# EAGLE design Power Board Testing Interface Board manufactured 2016-10-20 (EAGLE 7.7.0)
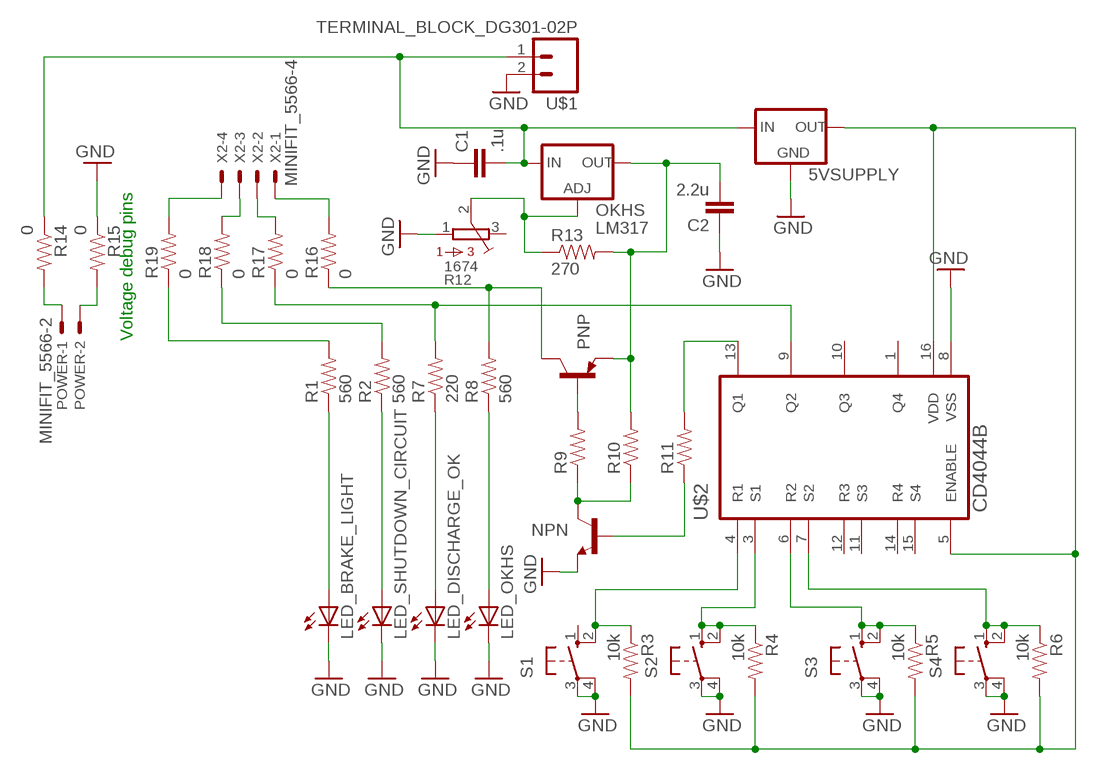
[diagram p0: schematic, sheet 1]

## Parts
5VSUPPLY  5V_REGULATOR_L7805SWITCHING  [TO-220]
C1  .1u  CAPEZ  [CAP-PTH-SMALLEZ]
C2  2.2u  CAPPTH1  [CAP-PTH-5MM]
LED_BRAKE_LIGHT  LED-5MM  [LED-5MM]
LED_DISCHARGE_OK  LED-5MM  [LED-5MM]
LED_OKHS  LED-5MM  [LED-5MM]
LED_SHUTDOWN_CIRCUIT  LED-5MM  [LED-5MM]
NPN  BJT_NPNTIP120  [TO-220]
OKHS  LM317  [TO-220]
PNP  BJT_PNP  [TO-220]
POWER  MINIFIT_5566-2  [MINIFIT_5566-2]
R1  560  RESISTOREZ  [AXIAL-0.3EZ]
R2  560  RESISTOREZ  [AXIAL-0.3EZ]
R3  10k  RESISTOREZ  [AXIAL-0.3EZ]
R4  10k  RESISTOREZ  [AXIAL-0.3EZ]
R5  10k  RESISTOREZ  [AXIAL-0.3EZ]
R6  10k  RESISTOREZ  [AXIAL-0.3EZ]
R7  220  RESISTOREZ  [AXIAL-0.3EZ]
R8  560  RESISTOREZ  [AXIAL-0.3EZ]
R9  RESISTOREZ  [AXIAL-0.3EZ]
R10  RESISTOREZ  [AXIAL-0.3EZ]
R11  RESISTOREZ  [AXIAL-0.3EZ]
R12  1674  TRIMPOT_3296C  [TRIMPOT_3296]
R13  270  RESISTOREZ  [AXIAL-0.3EZ]
R14  0  RESISTOREZ  [AXIAL-0.3EZ]
R15  0  RESISTOREZ  [AXIAL-0.3EZ]
R16  0  RESISTOREZ  [AXIAL-0.3EZ]
R17  0  RESISTOREZ  [AXIAL-0.3EZ]
R18  0  RESISTOREZ  [AXIAL-0.3EZ]
R19  0  RESISTOREZ  [AXIAL-0.3EZ]
S1  BTN_10-XX  [B3F-10XX]
S2  BTN_10-XX  [B3F-10XX]
S3  BTN_10-XX  [B3F-10XX]
S4  BTN_10-XX  [B3F-10XX]
U$1  TERMINAL_BLOCK_DG301-02P  [DG301-02P]
U$2  CD4044B  [DIL16]
X2  MINIFIT_5566-4  [MINIFIT_5566-4]

## Nets
5VSUPPLY: 5VSUPPLY.3(OUT) R3.P$2 R4.P$2 R5.P$2 R6.P$2 U$2.5(ENABLE) U$2.16(VDD)
12VSUPPLY: 5VSUPPLY.1(IN) C1.2 OKHS.3(IN) R14.P$1 U$1.1
GND: 5VSUPPLY.2(GND) C1.1 C2.1 LED_BRAKE_LIGHT.K(C) LED_DISCHARGE_OK.K(C) LED_OKHS.K(C) LED_SHUTDOWN_CIRCUIT.K(C) NPN.3(EMITTER) R12.1 R15.P$1 S1.3(P) S1.4(P1) S2.3(P) S2.4(P1) S3.3(P) S3.4(P1) S4.3(P) S4.4(P1) U$1.2 U$2.8(VSS)
N$2: R1.P$2 R19.P$1
N$3: LED_BRAKE_LIGHT.A R1.P$1
N$4: R2.P$2 R18.P$1
N$5: LED_SHUTDOWN_CIRCUIT.A R2.P$1
N$7: PNP.1(B) R9.P$2
N$8: R11.P$2 U$2.13(Q1)
N$9: R7.P$2 R17.P$1 U$2.9(Q2)
N$10: R3.P$1 S1.2(S1) U$2.4(R1)
N$11: R4.P$1 S2.1(S) S2.2(S1) U$2.3(S1)
N$12: LED_DISCHARGE_OK.A R7.P$1
N$13: LED_OKHS.A R8.P$1
N$14: R5.P$1 S3.1(S) S3.2(S1) U$2.6(R2)
N$15: R6.P$1 S4.1(S) S4.2(S1) U$2.7(S2)
N$16: PNP.2(C) R8.P$2 R16.P$1
N$17: NPN.2(COLLECTOR) R9.P$1 R10.P$1
N$18: NPN.1(BASE) R11.P$1
N$19: POWER.2 R15.P$2
N$20: OKHS.1(ADJ) R12.2 R13.P$1
N$21: C2.2 OKHS.2(OUT) PNP.3(E) R10.P$2 R13.P$2
N$22: POWER.1 R14.P$2
N$23: R16.P$2 X2.1
N$24: R17.P$2 X2.2
N$25: R18.P$2 X2.3
N$26: R19.P$2 X2.4
Unconnected: R12.3 S1.1(S) U$2.1(Q4) U$2.10(Q3) U$2.11(S3) U$2.12(R3) U$2.14(R4) U$2.15(S4)

## Notes on the sheet
- Voltage debug pins

## Library data of the parts
5VSUPPLY = HyTechDevices:5V_REGULATOR_L7805: Voltage Regulator Switching 5v regulator Datasheet <http://power.murata.com/data/power/oki-78sr.pdf> Standard 7805 5V regulator. IGO (Input Ground Output). Spark Fun Electronics SKU : COM-00107 Datasheet <http://www.mouser.com/ds/2/308/MC7800-D-94905.pdf>
C1 C2 = HyTechDevices:CAP: Capacitor Standard 0603 ceramic capacitor, and 0.1" leaded capacitor.
LED_BRAKE_LIGHT LED_DISCHARGE_OK LED_OKHS LED_SHUTDOWN_CIRCUIT = HyTechDevices:LED: Light Emitting Diode Source: Dangerous Prototypes Eagle Library <https://github.com/DangerousPrototypes/Eagle_Part_Library>
NPN = HyTechDevices:BJT_NPN: Generic NPN BJT MMBT2222A - TRANS-08049 (SOT-23, 1A 40V) MPSA42 - TRANS-09116 (SOT-23, 500mA 300V) MMBT5088LT1G - TRANS-11160 (SOT-23, 50 mA 30V) BC547 - COM-08928 <http://www.sparkfun.com/products/8928> (TO-92 45V 100mA) (1.Collector 2.Base 3.Emitter) 2N3904 - COM-00521 <http://www.sparkfun.com/products/521> (TO-92 40V 200mA) (1.Emitter 2.Base 3.Collector) P2N2222A - COM-12852 <http://www.sparkfun.com/products/12852> (TO-92 40V 600mA) (1.Collector 2.Base 3.Emitter) Source: Sparkfun <https://github.com/sparkfun/SparkFun-Eagle-Libraries>
OKHS = HyTechDevices:LM317: Adjustable Linear Regulator
PNP = HyTechDevices:BJT_PNP: Generic PNP BJT
POWER = HyTechDevices:MINIFIT_5566-2: Mini FIT Junior connector 2 pole Source: http://www.molex.com; OC_FARNELL: 1822072; OC_NEWARK: unknown
R1-R11 R13-R19 = HyTechDevices:RESISTOR: Resistor Basic schematic elements and footprints for 0603, 1206, and PTH resistors.
R12 = HyTechDevices:TRIMPOT_3296: 3296 Series 3/8" Square Trimmer Source <https://github.com/chiengineer/Eagle-Libraries/blob/master/Potentiometers/bourns.lbr>
S1-S4 = HyTechDevices:BTN_10-XX: OMRON SWITCH; MPN: B3F-1000; OC_FARNELL: 176432; OC_NEWARK: 36M3542
U$1 = HyTechDevices:TERMINAL_BLOCK_DG301-02P: DG301-02P Terminal block Tayda Electronics Store <http://www.taydaelectronics.com/connectors-sockets/terminal-blocks/dg301-screw-terminal-block-2-positions-5mm.html> Datasheet <http://www.tme.eu/en/Document/72ad9f371bb0c16572574ac47903b3a1/DG301-5.0.pdf> Specs: Positions: 2 Pitch: 5.00mm Wire: 12-24 AWG Max Current: 15A Max Voltage: 300V
U$2 = HyTechDevices:CD4044B: Texas Instruments CD4044B NAND R/S Latch CMOS Quad 3-State NAND R/S Latch
X2 = HyTechDevices:MINIFIT_5566-4: Mini FIT Junior connector 4 pole Source: http://www.molex.com; OC_FARNELL: unknown; OC_NEWARK: unknown

## Board
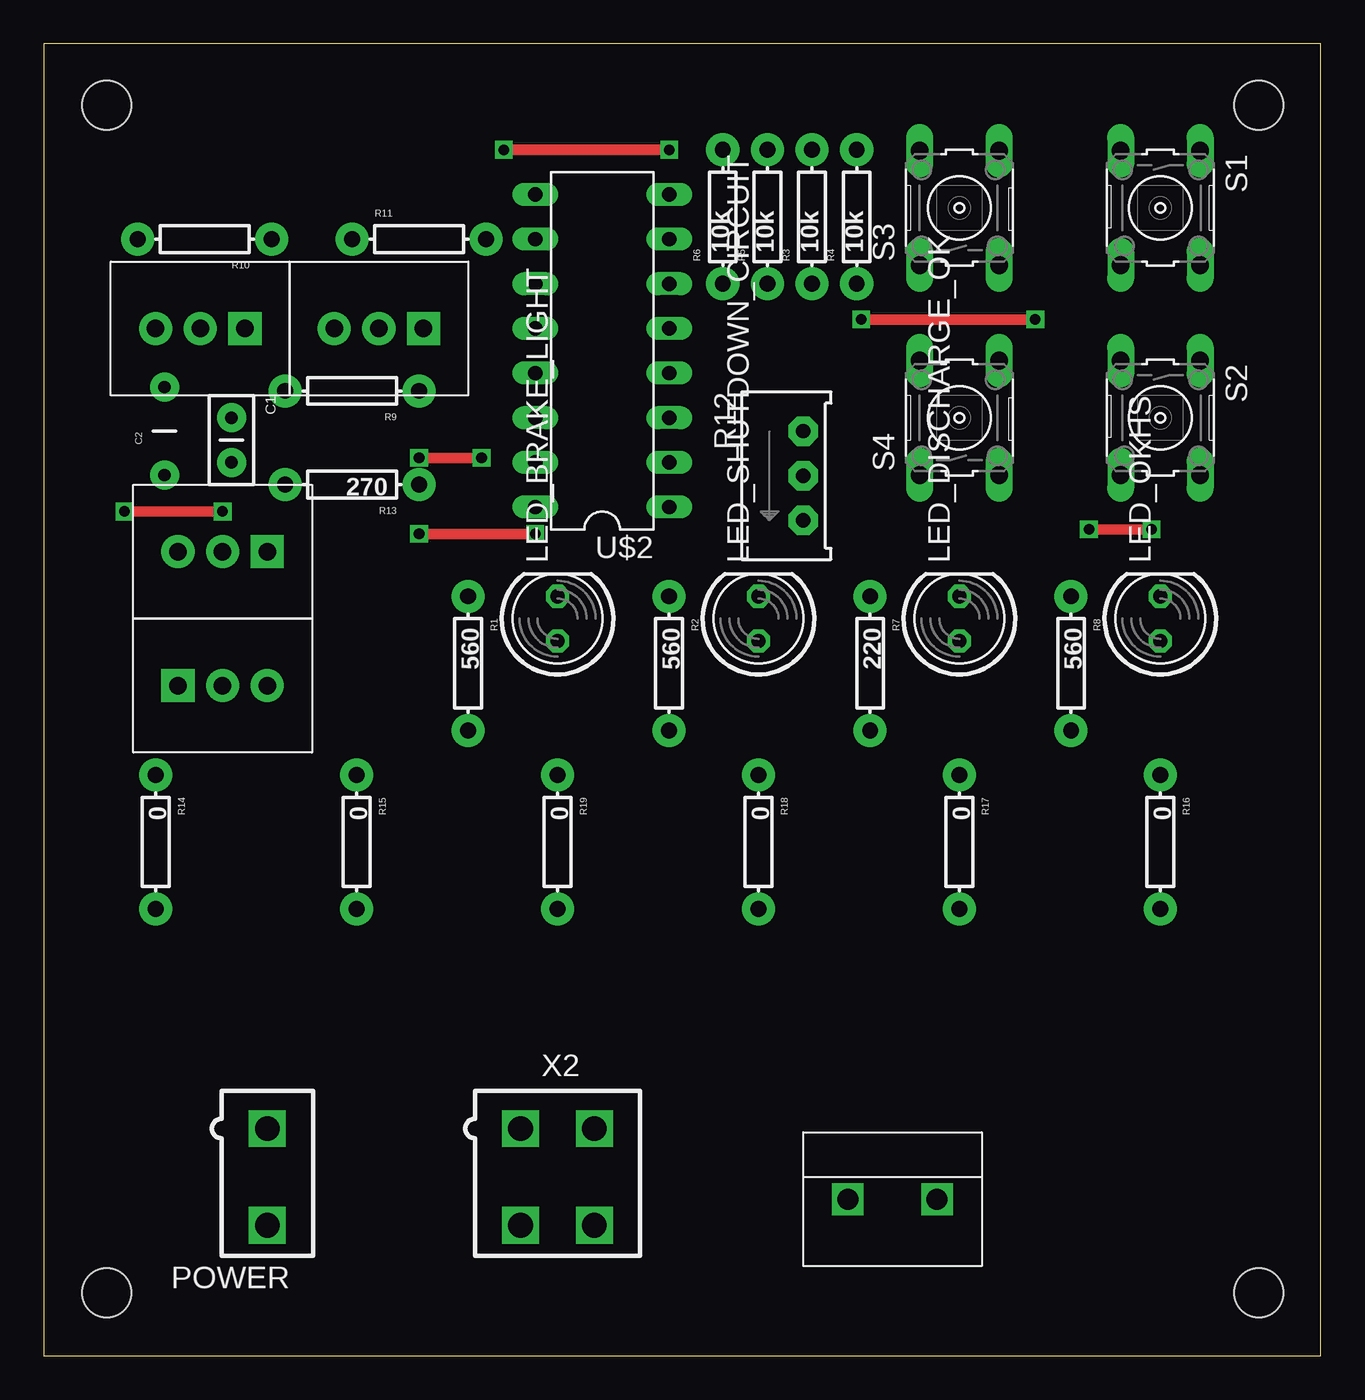
[diagram p1: board, top side]
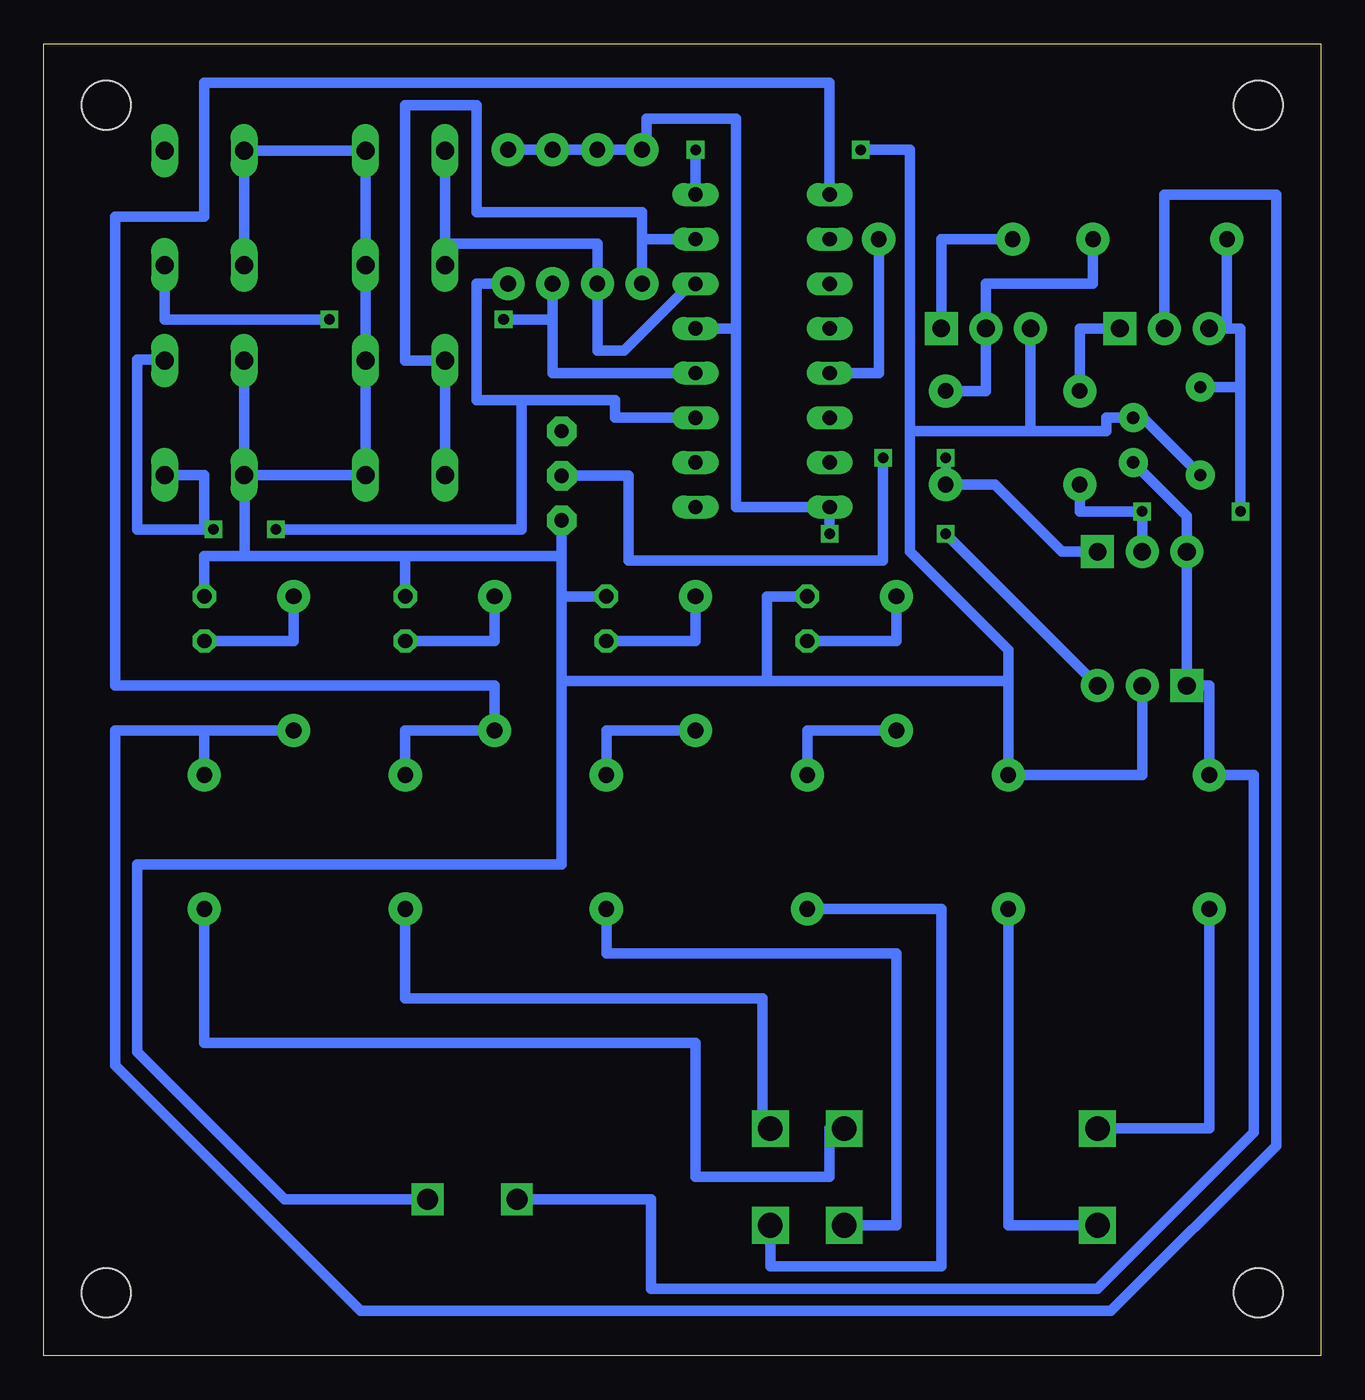
[diagram p2: board, bottom side, seen from below]

Size 72.62 x 74.6 mm. Coordinates in mm from the lower left corner, seen from the top.
Outline: 0,0 72.62,0 72.62,74.6 0,74.6 0,0
Copper layers (1*16): Top 0.035mm / dielectric 1.5mm / Bottom 0.035mm
Design rules "default": minimum track width 10mil, minimum drill 24mil, track to track 8mil, track to pad 8mil, pad to pad 8mil, via to via 8mil, smd to smd 8mil, copper to edge 40mil, drill to drill 8mil, minimum pad ring 10mil, minimum via ring 8mil, stop-mask expansion 4mil, vias tented up to drill 0mil, thermal gap 10mil
Holes 2.8 mm at 3.56,71.12 69.09,71.12 3.56,3.56 69.09,3.56

### Footprints (pad centres in the part's own frame; a part is rotated, then mirrored left to right if it is on the bottom)
TO-220 = drill 1 pad 1.88 square: 1 -2.54,0 | drill 1 pad 1.88: 2 0,0; 3 2.54,0
CAP-PTH-SMALLEZ = drill 0.7 pad 1.651: 1 0,0; 2 2.54,0
CAP-PTH-5MM = drill 0.7 pad 1.651: 1 -2.5,0; 2 2.5,0
LED-5MM = drill 0.813 octagon: A -1.27,0; K 1.27,0
MINIFIT_5566-2 = drill 1.4 square: 1 0,-2.75; 2 0,2.75
AXIAL-0.3EZ = drill 0.9 pad 1.88: P$1 -3.81,0; P$2 3.81,0
TRIMPOT_3296 = drill 0.813 pad 1.676 octagon: 1 2.54,1.27; 2 0,1.27; 3 -2.54,1.27
B3F-10XX = drill 1.016 long: 1 -3.251,2.261; 2 3.251,2.261; 3 -3.251,-2.261; 4 3.251,-2.261
DG301-02P = drill 1.2 square: 1 2.54,3.81; 2 7.62,3.81
DIL16 = drill 0.813 long: 1 -8.89,-3.81; 2 -6.35,-3.81; 3 -3.81,-3.81; 4 -1.27,-3.81; 5 1.27,-3.81; 6 3.81,-3.81; 7 6.35,-3.81; 8 8.89,-3.81; 9 8.89,3.81; 10 6.35,3.81; 11 3.81,3.81; 12 1.27,3.81; 13 -1.27,3.81; 14 -3.81,3.81; 15 -6.35,3.81; 16 -8.89,3.81
MINIFIT_5566-4 = drill 1.4 square: 1 2.1,-2.75; 2 -2.1,-2.75; 3 2.1,2.75; 4 -2.1,2.75

### Placement (x,y rotation side)
5VSUPPLY  10.16,38.1 0 top
C1  10.67,53.34 270 top
C2  6.86,52.58 90 top
LED_BRAKE_LIGHT  29.21,41.91 90 top
LED_DISCHARGE_OK  52.07,41.91 90 top
LED_OKHS  63.5,41.91 90 top
LED_SHUTDOWN_CIRCUIT  40.64,41.91 90 top
NPN  19.05,58.42 180 top
OKHS  10.16,45.72 180 top
PNP  8.89,58.42 180 top
POWER  12.7,10.16 180 top
R1  24.13,39.37 270 top
R2  35.56,39.37 270 top
R3  43.69,64.77 90 top
R4  46.23,64.77 90 top
R5  41.15,64.77 90 top
R6  38.61,64.77 90 top
R7  46.99,39.37 270 top
R8  58.42,39.37 270 top
R9  17.53,54.86 180 top
R10  9.14,63.5 180 top
R11  21.34,63.5 0 top
R12  41.91,50.04 270 top
R13  17.53,49.53 180 top
R14  6.35,29.21 270 top
R15  17.78,29.21 270 top
R16  63.5,29.21 270 top
R17  52.07,29.21 270 top
R18  40.64,29.21 270 top
R19  29.21,29.21 270 top
S1  63.5,65.28 270 top
S2  63.5,53.34 270 top
S3  52.07,65.28 90 top
S4  52.07,53.34 90 top
U$1  43.18,5.08 0 top
U$2  31.75,57.15 90 top
X2  29.21,10.16 180 top

### Tracks (layer width: path | path; a pad name or v marks a point on that pad's centre or on a via)
5VSUPPLY  (via drill 0.6)
  Top 0.61: v21.34,46.74 v27.94,46.74
  Bottom 0.61: U$2.5 33.27,58.42 | 33.27,58.42 33.27,48.26 U$2.16 v27.94,46.74 | R4.P$2 R3.P$2 R5.P$2 R6.P$2 38.35,68.58 38.35,70.36 33.27,70.36 33.27,58.42 | 5VSUPPLY.3 v21.34,46.74
12VSUPPLY
  Bottom 0.61: U$1.1 38.1,8.89 38.1,3.81 12.7,3.81 3.81,12.7 3.81,33.02 R14.P$1 6.35,38.1 5VSUPPLY.1 OKHS.3 7.62,47.75 C1.2
GND  (via drill 0.6)
  Top 0.61: v35.56,68.58 v26.16,68.58
  Bottom 0.61: LED_DISCHARGE_OK.K 52.07,45.47 | 52.07,45.47 43.18,45.47 | LED_OKHS.K 63.5,45.47 61.21,45.47 | 61.21,45.47 52.07,45.47 | 61.21,50.09 S2.4 S2.3 | 61.21,50.09 61.21,45.47 | R12.1 43.18,45.47 | 5VSUPPLY.2 10.16,33.02 R15.P$1 17.78,38.35 | 16.51,52.58 23.37,52.58 | 23.37,52.58 23.37,45.72 17.78,40.13 17.78,38.35 | NPN.3 16.51,52.58 | S1.4 S1.3 S3.4 S3.3 S4.4 S4.3 61.21,50.09 | 43.18,38.35 43.18,27.94 67.31,27.94 67.31,17.27 58.93,8.89 U$1.2 | 43.18,38.35 43.18,43.18 | 43.18,43.18 43.18,45.47 | 23.37,52.58 23.37,68.58 v26.16,68.58 | U$2.8 v35.56,68.58 | LED_BRAKE_LIGHT.K 31.5,43.18 31.5,38.35 | 31.5,38.35 17.78,38.35 | LED_SHUTDOWN_CIRCUIT.K 43.18,43.18 | 31.5,38.35 43.18,38.35 | 16.51,52.58 12.19,52.58 12.19,53.34 C1.1 10.12,53.34 C2.1
N$2
  Bottom 0.61: R19.P$1 29.21,35.56 R1.P$2
N$3
  Bottom 0.61: R1.P$1 24.13,40.64 LED_BRAKE_LIGHT.A
N$4
  Bottom 0.61: R18.P$1 40.64,35.56 R2.P$2
N$5
  Bottom 0.61: R2.P$1 35.56,40.64 LED_SHUTDOWN_CIRCUIT.A
N$7
  Bottom 0.61: PNP.1 13.72,58.42 R9.P$2
N$8
  Bottom 0.61: R11.P$2 25.15,55.88 U$2.13
N$9
  Bottom 0.61: R17.P$1 52.07,35.56 R7.P$2 46.99,38.1 68.58,38.1 68.58,64.77 63.5,64.77 63.5,72.39 27.94,72.39 U$2.9
N$10  (via drill 0.6)
  Top 0.61: v46.48,58.93 v56.39,58.93
  Bottom 0.61: U$2.4 43.69,55.88 43.69,58.93 | v56.39,58.93 65.76,58.93 S1.2 | R3.P$1 43.69,58.93 | v46.48,58.93 43.69,58.93
N$11  (via drill 0.6)
  Top 0.61: v59.44,46.99 v62.99,46.99
  Bottom 0.61: U$2.3 40.13,53.34 40.13,54.36 45.47,54.36 | 45.47,54.36 45.47,46.99 v59.44,46.99 | v62.99,46.99 63.5,46.99 | 63.5,46.99 67.31,46.99 67.31,56.64 65.76,56.64 S2.1 | S2.2 63.5,50.09 63.5,46.99 | R4.P$1 48.01,60.96 48.01,54.36 45.47,54.36
N$12
  Bottom 0.61: R7.P$1 46.99,40.64 LED_DISCHARGE_OK.A
N$13
  Bottom 0.61: R8.P$1 58.42,40.64 LED_OKHS.A
N$14
  Bottom 0.61: S3.2 49.81,63.25 | 49.81,63.25 S3.1 | 49.81,63.25 41.15,63.25 R5.P$1 41.15,57.15 39.62,57.15 35.81,60.96 U$2.6
N$15
  Bottom 0.61: S4.1 S4.2 52.07,56.59 52.07,71.12 48.01,71.12 48.01,65.02 38.61,65.02 38.61,63.5 | U$2.7 38.61,63.5 | 38.61,63.5 R6.P$1
N$16
  Bottom 0.61: R8.P$2 63.5,35.56 | 63.5,35.56 R16.P$1 | PNP.2 8.89,66.04 2.54,66.04 2.54,11.94 11.94,2.54 54.61,2.54 68.58,16.51 68.58,35.56 63.5,35.56
N$17
  Bottom 0.61: R9.P$1 19.05,54.86 NPN.2 19.05,60.96 12.95,60.96 R10.P$1
N$18
  Bottom 0.61: R11.P$1 21.59,63.5 NPN.1
N$19
  Bottom 0.61: POWER.2 17.78,7.41 R15.P$2
N$20  (via drill 0.6)
  Top 0.61: v24.89,51.05 v21.34,51.05
  Bottom 0.61: R12.2 39.37,50.04 39.37,45.21 24.89,45.21 v24.89,51.05 | v21.34,51.05 R13.P$1 18.54,49.53 14.73,45.72 OKHS.1
N$21  (via drill 0.6)
  Top 0.61: v4.57,48.01 v10.16,48.01
  Bottom 0.61: R13.P$2 13.72,48.01 v10.16,48.01 OKHS.2 | 4.57,55.08 4.57,58.42 5.59,58.42 | 4.57,55.08 v4.57,48.01 | R10.P$2 5.33,58.67 5.59,58.42 | PNP.3 5.59,58.42 | C2.2 4.57,55.08
N$22
  Bottom 0.61: POWER.1 6.35,12.91 R14.P$2
N$23
  Bottom 0.61: X2.1 27.94,12.91 27.94,10.16 35.56,10.16 35.56,17.78 63.5,17.78 R16.P$2
N$24
  Bottom 0.61: X2.2 31.75,12.91 31.75,20.32 52.07,20.32 R17.P$2
N$25
  Bottom 0.61: X2.3 24.13,7.41 24.13,22.86 40.64,22.86 R18.P$2
N$26
  Bottom 0.61: R19.P$2 21.59,25.4 21.59,5.08 31.31,5.08 X2.4